# Altium schematic sheet ultrasonic_tx.SchDoc: OPO
size Letter; Author: Kuo, Huang; Revision: 4.0; SheetNumber: 7; SheetTotal: 7
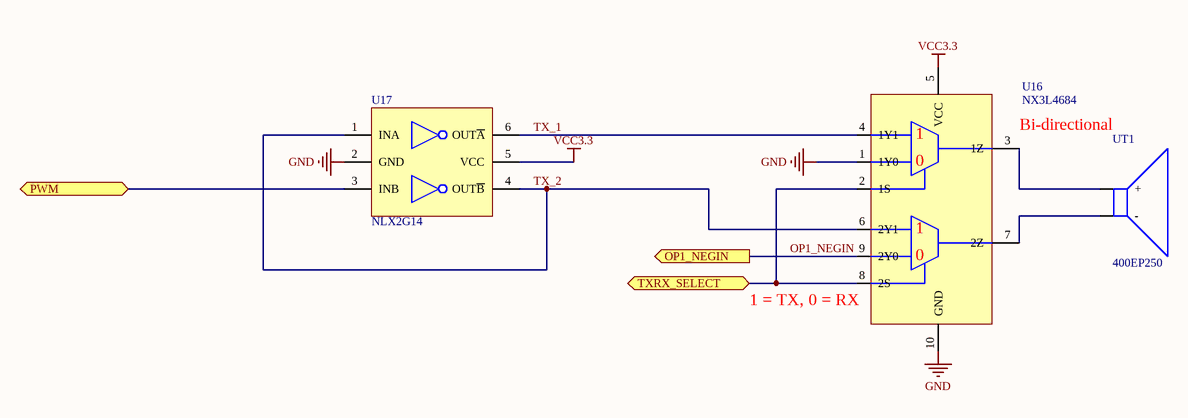
[diagram p0: ultrasonic_tx.SchDoc]

## Parts
U16  NX3L4684  [QFN50P155X200X13-10N]
U17  NLX2G14  [ULLGA6]
UT1  400EP250  [Transducer recepticle]

## Ports
OP1_NEGIN (out), PWM, TXRX_SELECT

## Nets
GND: U16.1(1Y0) U16.10(GND) U17.2(GND)
VCC3.3: U16.5(VCC) U17.5(VCC)
OP1_NEGIN: U16.9(2Y0) ; port OP1_NEGIN
PWM: U17.3(INB) ; port PWM
TX_1: U16.4(1Y1) U17.6(OUT~{A})
TX_2: U16.6(2Y1) U17.1(INA) U17.4(OUT~{B})
TXRX_SELECT: U16.2(1S) U16.8(2S) ; port TXRX_SELECT
NetU16_3: U16.3(1Z) UT1.2(+)
NetU16_7: U16.7(2Z) UT1.1(-)

## Notes on the sheet
- (near U16) Bi-directional
- (near U16) 1 = TX, 0 = RX
- Title
- Date:
- Author:
- Revision:
- Sheet
- of
- University of Michigan
- File:
- (in symbol NX3L4684) 0

## Library data of the parts
U16 = NX3L4684: IC ANALOG SWITCH SPDT 10XQFN; Supplier 1: Digi-Key; Supplier Part Number 1: 568-5564-1-ND
U17 = NLX2G14: Dual Schmitt-Trigger  Inverter; Supplier 1: Digi-Key; Supplier Part Number 1: NLX2G14AMX1TCGOSCT-ND
UT1 = Tranducer: Air Ultrasounic Ceramic Transducers; Supplier 1: Digi-Key; Supplier Part Number 1: ED90088-ND